# EAGLE schematic pimp (EAGLE 9.6.1)
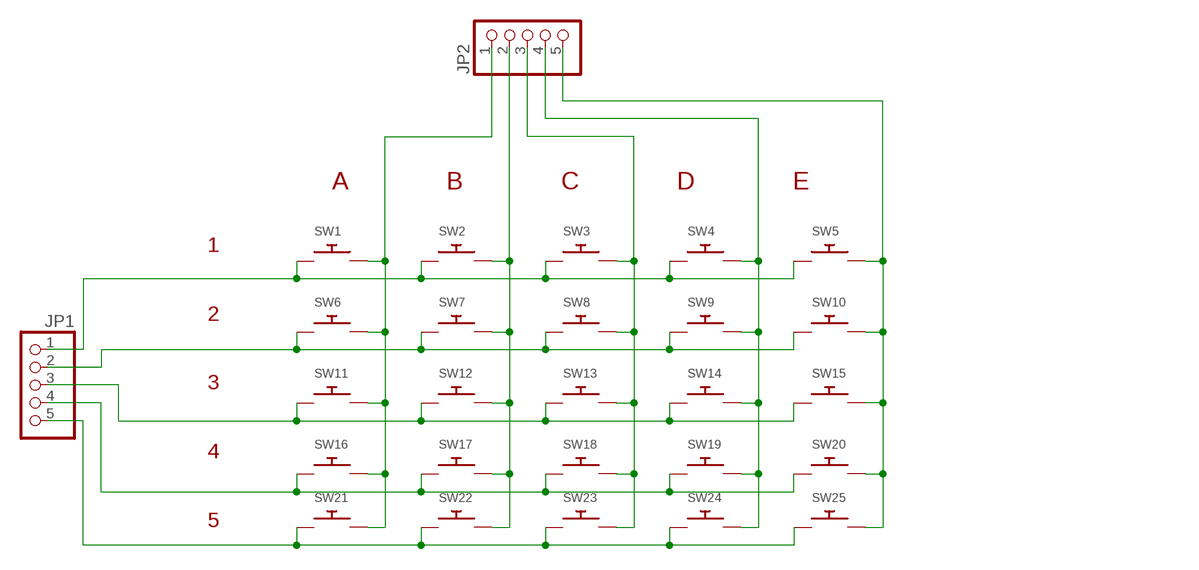
[diagram p0: schematic, sheet 1]

## Parts
JP1  PINHD-1X5  [1X05]
JP2  PINHD-1X5  [1X05]
SW1  SWITCH_PUSHBUTTONC&K_KSS  [BTN_CK_KSS]
SW2  SWITCH_PUSHBUTTONC&K_KSS  [BTN_CK_KSS]
SW3  SWITCH_PUSHBUTTONC&K_KSS  [BTN_CK_KSS]
SW4  SWITCH_PUSHBUTTONC&K_KSS  [BTN_CK_KSS]
SW5  SWITCH_PUSHBUTTONC&K_KSS  [BTN_CK_KSS]
SW6  SWITCH_PUSHBUTTONC&K_KSS  [BTN_CK_KSS]
SW7  SWITCH_PUSHBUTTONC&K_KSS  [BTN_CK_KSS]
SW8  SWITCH_PUSHBUTTONC&K_KSS  [BTN_CK_KSS]
SW9  SWITCH_PUSHBUTTONC&K_KSS  [BTN_CK_KSS]
SW10  SWITCH_PUSHBUTTONC&K_KSS  [BTN_CK_KSS]
SW11  SWITCH_PUSHBUTTONC&K_KSS  [BTN_CK_KSS]
SW12  SWITCH_PUSHBUTTONC&K_KSS  [BTN_CK_KSS]
SW13  SWITCH_PUSHBUTTONC&K_KSS  [BTN_CK_KSS]
SW14  SWITCH_PUSHBUTTONC&K_KSS  [BTN_CK_KSS]
SW15  SWITCH_PUSHBUTTONC&K_KSS  [BTN_CK_KSS]
SW16  SWITCH_PUSHBUTTONC&K_KSS  [BTN_CK_KSS]
SW17  SWITCH_PUSHBUTTONC&K_KSS  [BTN_CK_KSS]
SW18  SWITCH_PUSHBUTTONC&K_KSS  [BTN_CK_KSS]
SW19  SWITCH_PUSHBUTTONC&K_KSS  [BTN_CK_KSS]
SW20  SWITCH_PUSHBUTTONC&K_KSS  [BTN_CK_KSS]
SW21  SWITCH_PUSHBUTTONC&K_KSS  [BTN_CK_KSS]
SW22  SWITCH_PUSHBUTTONC&K_KSS  [BTN_CK_KSS]
SW23  SWITCH_PUSHBUTTONC&K_KSS  [BTN_CK_KSS]
SW24  SWITCH_PUSHBUTTONC&K_KSS  [BTN_CK_KSS]
SW25  SWITCH_PUSHBUTTONC&K_KSS  [BTN_CK_KSS]

## Nets
1: JP1.1 SW1.P$1 SW2.P$1 SW3.P$1 SW4.P$1 SW5.P$1
2: JP1.2 SW6.P$1 SW7.P$1 SW8.P$1 SW9.P$1 SW10.P$1
3: JP1.3 SW11.P$1 SW12.P$1 SW13.P$1 SW14.P$1 SW15.P$1
4: JP1.4 SW16.P$1 SW17.P$1 SW18.P$1 SW19.P$1 SW20.P$1
5: JP1.5 SW21.P$1 SW22.P$1 SW23.P$1 SW24.P$1 SW25.P$1
A: JP2.1 SW1.P$2 SW6.P$2 SW11.P$2 SW16.P$2 SW21.P$2
B: JP2.2 SW2.P$2 SW7.P$2 SW12.P$2 SW17.P$2 SW22.P$2
C: JP2.3 SW3.P$2 SW8.P$2 SW13.P$2 SW18.P$2 SW23.P$2
D: JP2.4 SW4.P$2 SW9.P$2 SW14.P$2 SW19.P$2 SW24.P$2
E: JP2.5 SW5.P$2 SW10.P$2 SW15.P$2 SW20.P$2 SW25.P$2

## Notes on the sheet
- A              B              C              D              E
- 1
  
  
  2
  
  
  3
  
  
  4
  
  
  5

## Library data of the parts
JP1 JP2 = pinhead:PINHD-1X5: PIN HEADER
SW1-SW25 = adafruit_changed:SWITCH_PUSHBUTTON: Buttons SOFTTOUCHSMD_SJ - Soft touch temporary push button (Super Junk Akihabara) Compatible with SKPMANE010 [Mouser: 688-SKPMAN] C&K_KSS = Digikey: KSS221GLFS